# Altium schematic sheet ADC.SchDoc
size 420 x 297 mm; Address1: Address1; Address2: Address2; Address3: Address3; Address4: Address4; SheetNumber: 1; Scale: 1:1; Разраб.: Иванов; Обозначение документа: ADC; Пров.: Петров; Утв.: Сидоров; Наименование организации: ОАО "Концерн "МПО-Гидроприбор"; Перв. применение: АБВГ.123456.000; Наименование изделия 1: Плата; Наименование изделия 2: Схема электрическая; Наименование изделия 3: принципиальная; Нач. отд.: Нач. отд.; Фамилия нач. отд.: Сидоров
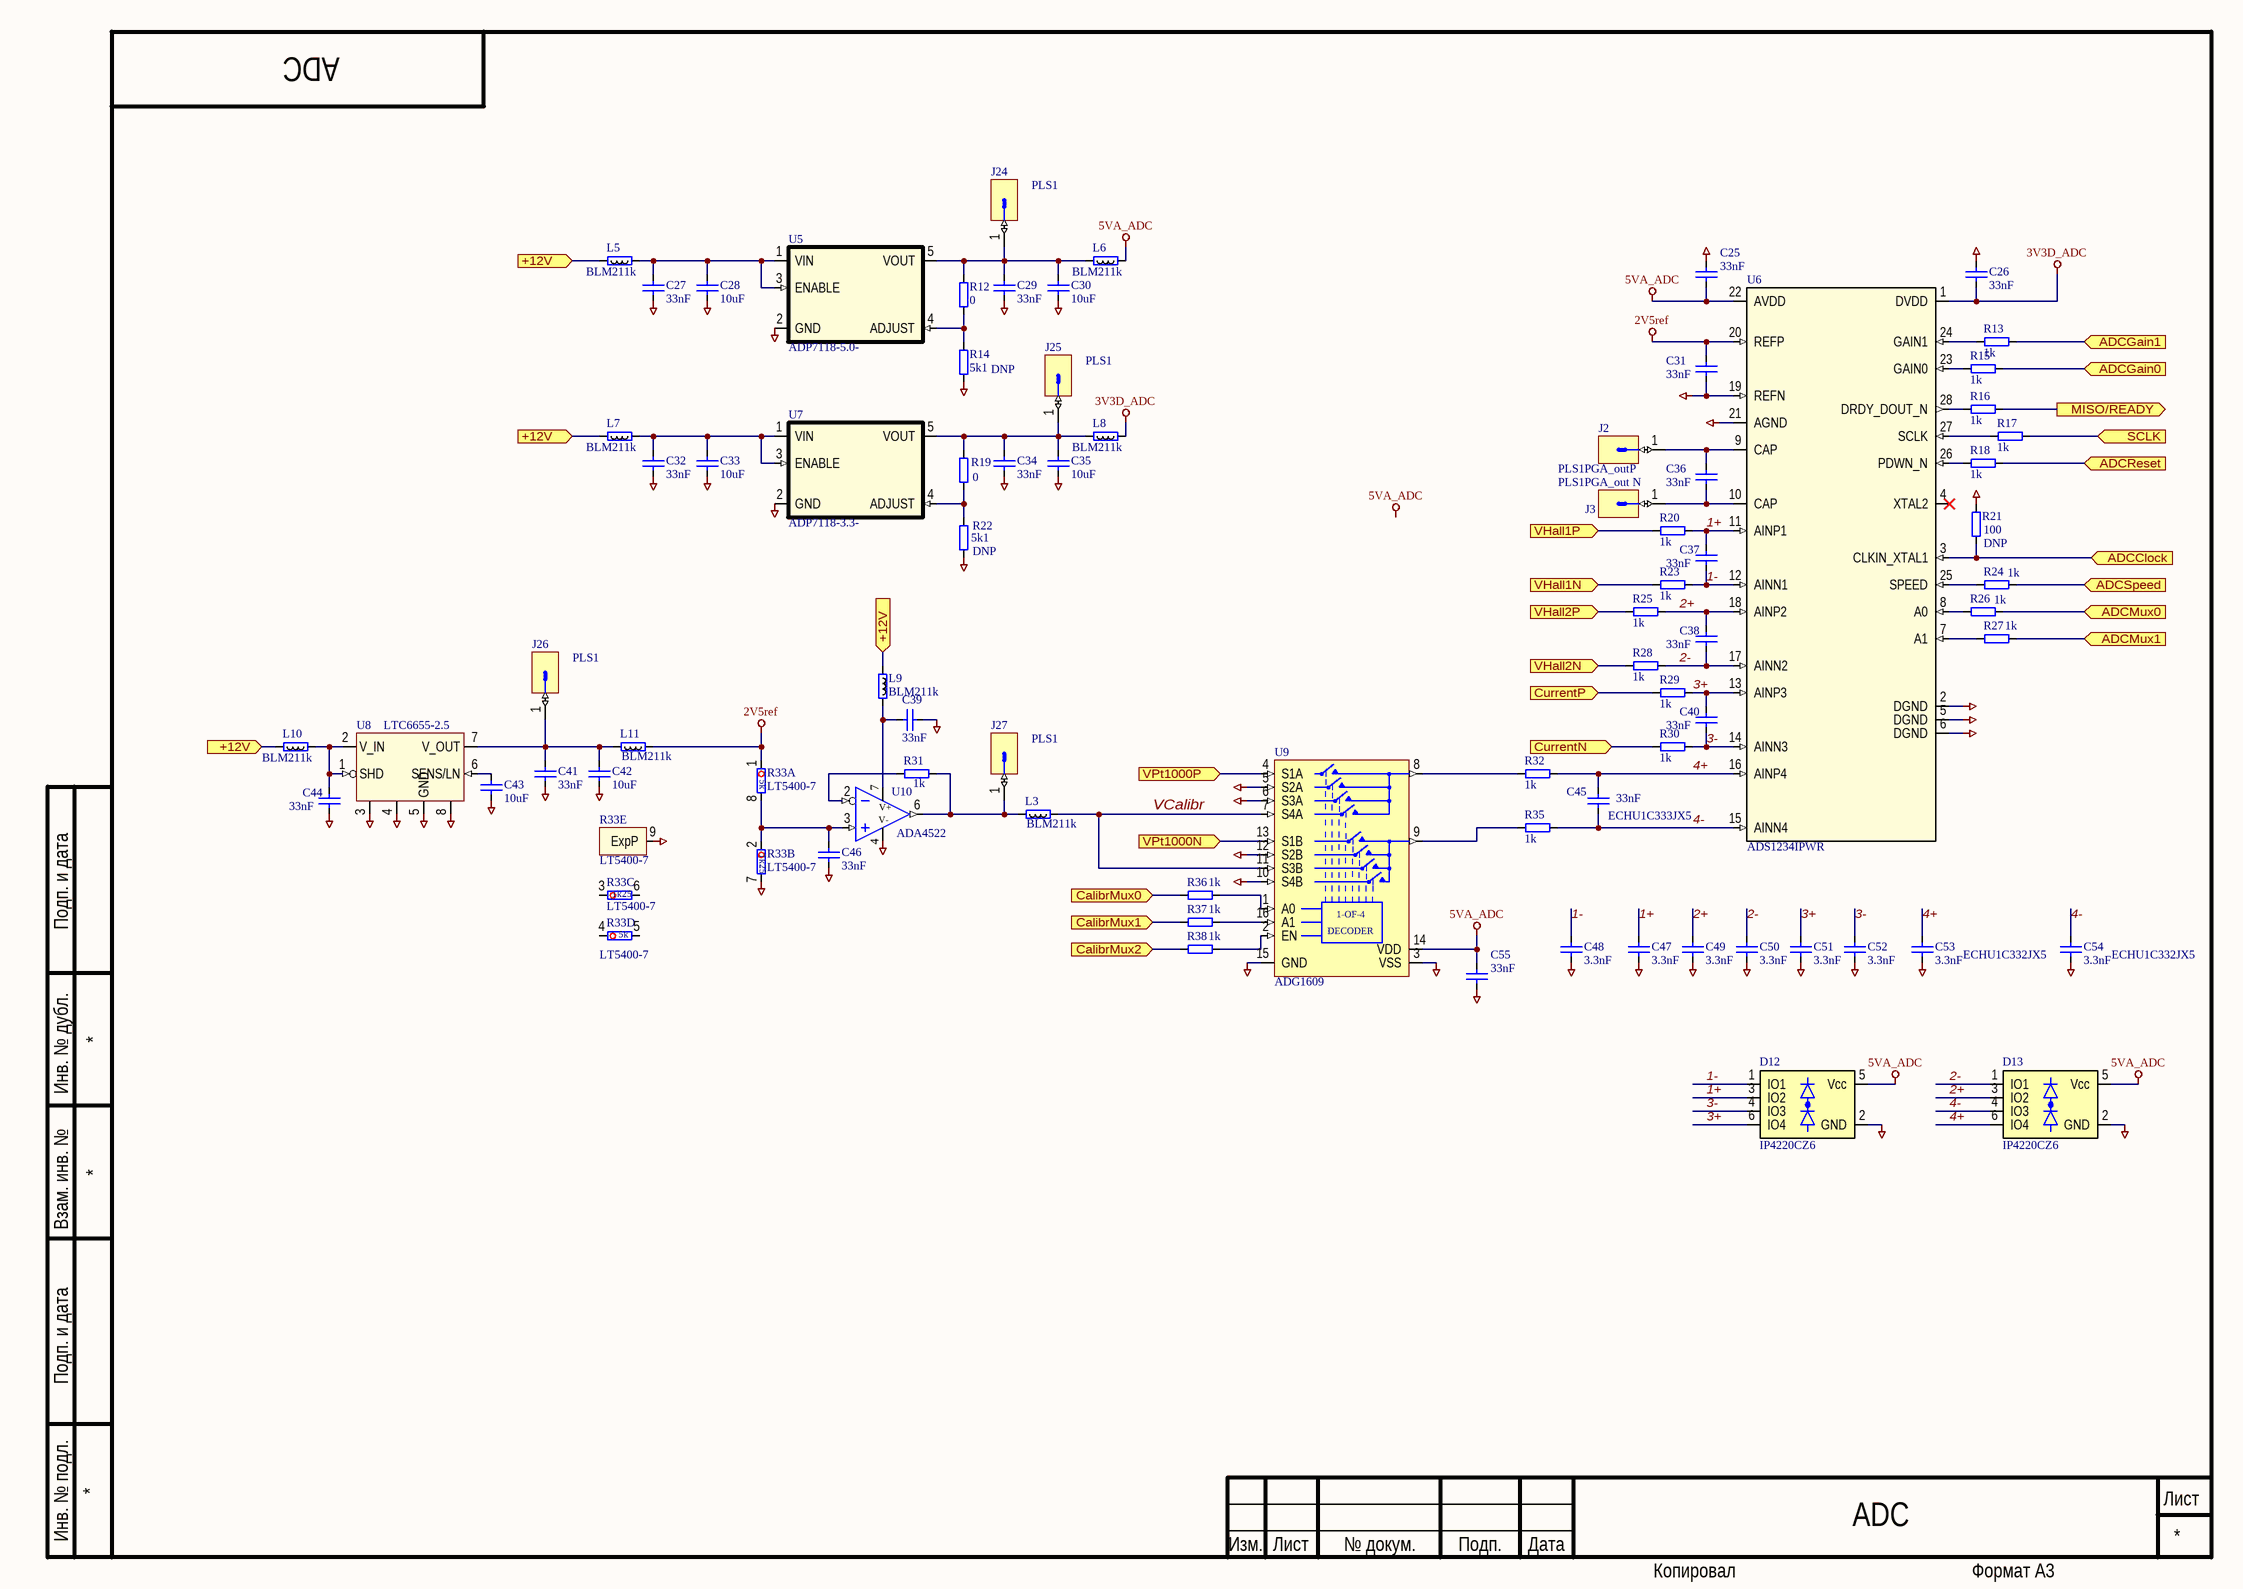
[diagram p0: ADC.SchDoc]

## Parts
C25  33nF  [CAPC1608X87N]
C26  33nF  [CAPC1608X87N]
C27  33nF  [SMD0805CAP]
C28  10uF  [SMD0805CAP]
C29  33nF  [SMD0805CAP]
C30  10uF  [SMD0805CAP]
C31  33nF  [CAPC1608X87N]
C32  33nF  [SMD0805CAP]
C33  10uF  [SMD0805CAP]
C34  33nF  [SMD0805CAP]
C35  10uF  [SMD0805CAP]
C36  33nF  [CAPC1608X87N]
C37  33nF  [CAPC1608X87N]
C38  33nF  [CAPC1608X87N]
C39  33nF  [SMD0805CAP]
C40  33nF  [CAPC1608X87N]
C41  33nF  [SMD0805CAP]
C42  10uF  [SMD0805CAP]
C43  10uF  [SMD0805CAP]
C44  33nF  [SMD0805CAP]
C45  33nF  Name to order: ECHU1C333JX5  [CAPC1206]
C46  33nF  [SMD0805CAP]
C47  3.3nF  [CAPC1608X87N]
C48  3.3nF  [CAPC1608X87N]
C49  3.3nF  [CAPC1608X87N]
C50  3.3nF  [CAPC1608X87N]
C51  3.3nF  [CAPC1608X87N]
C52  3.3nF  [CAPC1608X87N]
C53  3.3nF  Name to order: ECHU1C332JX5  [SMD0805CAP]
C54  3.3nF  Name to order: ECHU1C332JX5  [SMD0805CAP]
C55  33nF  [CAPC1608X87N]
D12  IP4220CZ6  [SOT95P270X145-6N]
D13  IP4220CZ6  [SOT95P270X145-6N]
J2  PLS1PGA_outP  [PLS1]
J3  PLS1PGA_out N  [PLS1]
J24  PLS1  [PLS1]
J25  PLS1  [PLS1]
J26  PLS1  [PLS1]
J27  PLS1  [PLS1]
L3  BLM211k  [RESC2012X50N]
L5  BLM211k  [RESC2012X50N]
L6  BLM211k  [RESC2012X50N]
L7  BLM211k  [RESC2012X50N]
L8  BLM211k  [RESC2012X50N]
L9  BLM211k  [RESC2012X50N]
L10  BLM211k  [RESC2012X50N]
L11  BLM211k  [RESC2012X50N]
R12  0  [SMD0805RES]
R13  1k  [SMD0805RES]
R14  5k1  Solder Option: DNP  [SMD0805RES]
R15  1k  [SMD0805RES]
R16  1k  [SMD0805RES]
R17  1k  [SMD0805RES]
R18  1k  [SMD0805RES]
R19  0  [SMD0805RES]
R20  1k  [SMD0805RES]
R21  100  Solder Option: DNP  [SMD0805RES]
R22  5k1  Solder Option: DNP  [SMD0805RES]
R23  1k  [SMD0805RES]
R24  1k  [SMD0805RES]
R25  1k  [SMD0805RES]
R26  1k  [SMD0805RES]
R27  1k  [SMD0805RES]
R28  1k  [SMD0805RES]
R29  1k  [SMD0805RES]
R30  1k  [SMD0805RES]
R31  1k  [SMD0805RES]
R32  1k  [SMD0805RES]
R33  LT5400-7  [SOP65P488X110-9N-R178X241]  (parts A,B,C,D,E of 5)
R35  1k  [SMD0805RES]
R36  1k  [SMD0805RES]
R37  1k  [SMD0805RES]
R38  1k  [SMD0805RES]
U5  ADP7118-5.0-  [SOT23-5]
U6  ADS1234IPWR  [SOP65P780X200-28N]
U7  ADP7118-3.3-  [SOT23-5]
U8  LTC6655-2.5  [SOP65P488X110-8N]
U9  ADG1609  [TSSOP-16]
U10  ADA4522  [SOP65P488X110-8N]

## Ports
+12V (in), ADCClock (in), ADCGain0 (in), ADCGain1 (in), ADCMux0 (in), ADCMux1 (in), ADCReset (in), ADCSpeed (in), CalibrMux0 (in), CalibrMux1 (in), CalibrMux2 (in), CurrentN (in), CurrentP (in), MISO/READY (out), SCLK (in), VHall1N (in), VHall1P (in), VHall2N (in), VHall2P (in), VPt1000N (in), VPt1000P (in)

## Nets
2V5ref: C31.2 L11.2 R33.1 U6.20(REFP)
3V3D_ADC: C26.1 L8.2 U6.1(DVDD)
5VA_ADC: C25.1 C55.2 D12.5(Vcc) D13.5(Vcc) L6.2 U6.22(AVDD) U9.14(VDD)
GND: C25.2 C26.2 C27.1 C28.1 C29.1 C30.1 C31.1 C32.1 C33.1 C34.1 C35.1 C39.1 C41.1 C42.1 C43.1 C44.1 C46.1 C47.1 C48.1 C49.1 C50.1 C51.1 C52.1 C53.1 C54.1 C55.1 D12.2(GND) D13.2(GND) R14.1 R21.2 R22.1 R33.7 R33.9(ExpP) U5.2(GND) U6.2(DGND) U6.5(DGND) U6.6(DGND) U6.19(REFN) U6.21(AGND) U7.2(GND) U8.3(GND) U8.4(GND) U8.5(GND) U8.8(GND) U9.3(VSS) U9.5(S2A) U9.6(S3A) U9.10(S4B) U9.12(S2B) U9.15(GND) U10.4(V-)
1+: C37.2 C47.2 D12.3(IO2) R20.2 U6.11(AINP1)
1-: C37.1 C48.2 D12.1(IO1) R23.2 U6.12(AINN1)
2+: C38.2 C49.2 D13.3(IO2) R25.2 U6.18(AINP2)
2-: C38.1 C50.2 D13.1(IO1) R28.2 U6.17(AINN2)
3+: C40.2 C51.2 D12.6(IO4) R29.2 U6.13(AINP3)
3-: C40.1 C52.2 D12.4(IO3) R30.2 U6.14(AINN3)
4+: C45.2 C53.2 D13.6(IO4) R32.2 U6.16(AINP4)
4-: C45.1 C54.2 D13.4(IO3) R35.2 U6.15(AINN4)
+12V: L5.1 L7.1 L9.2 L10.1 ; port +12V
ADCClock: R21.1 U6.3(CLKIN_XTAL1) ; port ADCClock
ADCGain0: R15.2 ; port ADCGain0
ADCGain1: R13.2 ; port ADCGain1
ADCMux0: R26.2 ; port ADCMux0
ADCMux1: R27.2 ; port ADCMux1
ADCReset: R18.2 ; port ADCReset
ADCSpeed: R24.2 ; port ADCSpeed
CalibrMux0: R36.1 ; port CalibrMux0
CalibrMux1: R37.1 ; port CalibrMux1
CalibrMux2: R38.1 ; port CalibrMux2
CurrentN: R30.1 ; port CurrentN
CurrentP: R29.1 ; port CurrentP
MISO/READY: R16.2 ; port MISO/READY
SCLK: R17.2 ; port SCLK
VCalibr: L3.2 U9.7(S4A) U9.11(S3B)
VHall1N: R23.1 ; port VHall1N
VHall1P: R20.1 ; port VHall1P
VHall2N: R28.1 ; port VHall2N
VHall2P: R25.1 ; port VHall2P
VPt1000N: U9.13(S1B) ; port VPt1000N
VPt1000P: U9.4(S1A) ; port VPt1000P
NetC27_2: C27.2 C28.2 L5.2 U5.1(VIN) U5.3(ENABLE)
NetC29_2: C29.2 C30.2 J24.1 L6.1 R12.2 U5.5(VOUT)
NetC32_2: C32.2 C33.2 L7.2 U7.1(VIN) U7.3(ENABLE)
NetC34_2: C34.2 C35.2 J25.1 L8.1 R19.2 U7.5(VOUT)
NetC36_1: C36.1 J3.1 U6.10(CAP)
NetC36_2: C36.2 J2.1 U6.9(CAP)
NetC39_2: C39.2 L9.1 U10.7(V+)
NetC41_2: C41.2 C42.2 J26.1 L11.1 U8.7(V_OUT)
NetC43_2: C43.2 U8.6(SENS/LN)
NetC44_2: C44.2 L10.2 U8.1(SHD) U8.2(V_IN)
NetC46_2: C46.2 R33.2 R33.8 U10.3(IN+)
NetJ27_1: J27.1 L3.1 R31.2 U10.6(OUT)
NetR12_1: R12.1 R14.2 U5.4(ADJUST)
NetR13_1: R13.1 U6.24(GAIN1)
NetR15_1: R15.1 U6.23(GAIN0)
NetR16_1: R16.1 U6.28(DRDY_DOUT_N)
NetR17_1: R17.1 U6.27(SCLK)
NetR18_1: R18.1 U6.26(PDWN_N)
NetR19_1: R19.1 R22.2 U7.4(ADJUST)
NetR24_1: R24.1 U6.25(SPEED)
NetR26_1: R26.1 U6.8(A0)
NetR27_1: R27.1 U6.7(A1)
NetR31_1: R31.1 U10.2(IN-)
NetR32_1: R32.1 U9.8(DA)
NetR35_1: R35.1 U9.9(DB)
NetR36_2: R36.2 U9.1(A0)
NetR37_2: R37.2 U9.16(A1)
NetR38_2: R38.2 U9.2(EN)

Not connected (* = marked no-connect by the designer): R33 3 4 5 6; U6 4(XTAL2)*

## Notes on the sheet
- Labels drawn without touching a wire or pin: 5VA_ADC
- Подп. и дата
- Инв. № дубл.
- Взам. инв. №
- Инв. № подл.
- Изм.
- Лист
- № докум.
- Подп.
- Дата
- Копировал
- Формат А3
- (in symbol ADG1609) 1-OF-4; DECODER
- (in symbol LT5400_7, part A) 5k
- (in symbol LT5400_7, part B) 1k25
- (in symbol LT5400_7, part C) 1k25
- (in symbol LT5400_7, part D) 5k

## Library data of the parts
C25 C26 C31 C36-C38 C40 C47-C52 C55 = C0603: Чип конденсатор 0603; Voltage: 50V; Vendor: Vishay; DielectricType: X5R; SMD Solders: 2; Solder Option: RM; Tolerance: 20%; Pkg: SMD0603; Device: Cap603; Price: 2
  C25 C26 C31 C36-C38 C40 C55: Value: 33nF
  C47-C52: Value: 3.3nF
C27-C30 C32-C35 C39 C41-C44 C46 C53 C54 = C0805: Чип конденсатор 0805; Voltage: 25V; Vendor: Vishay; DielectricType: X5R; SMD Solders: 2; Solder Option: RM; Tolerance: 20%; Pkg: SMD0805; Device: Cap0805; Price: 2
  C27 C29 C32 C34 C39 C41 C44 C46: Value: 33nF
  C28 C30 C33 C35 C42 C43: Value: 10uF
  C53 C54: Value: 3.3nF
C45 = C1206: Чип конденсатор 1206; Voltage: 16V; Vendor: Vishay; DielectricType: X5R; SMD Solders: 2; Solder Option: RM; Tolerance: 1%; Pkg: SMD1206; Device: Cap1206; Value: 33nF; Price: 2
D12 D13 = IP4220: Optotransistor; Pkg: SOT23-6; SMD Solders: 6; Solder Option: RM; THD Solders: 0; Vendor: NXP; Voltage: 6V; Device: IP4220CZ6; Price: 10; Name to order: IP4220CZ6; Current: 0
J2 J3 J24-J27 = PLS1: Штырь PLS1; Vendor: Confly; SMD Solders: 0; Solder Option: RM; THD Solders: 1; Price: 1; Device: PLS1
  J2: Value: PGA_outP
  J3: Value: PGA_out N
L3 L5-L11 = BLM21: SMD Ferrite bead 0805; Vendor: Vishay; Value: 1k; Pkg: SMD0805; SMD Solders: 2; Solder Option: RM; Price: 10; Device: BLM21
R12 R13 R15-R20 R23-R32 R35-R38 = R0805: Чип резистор 0805; Vendor: Vishay; SMD Solders: 2; Solder Option: RM; TC: 100ppm/C; Tolerance: 1%; Pkg: SMD0805; Pwr: 125mW; Device: Res0805; Price: 2
  R12 R19: Value: 0
  R13 R15-R18 R20 R23-R32 R35-R38: Value: 1k
R14 R21 R22 = R0805: Чип резистор 0805; Vendor: Vishay; SMD Solders: 2; TC: 100ppm/C; Tolerance: 1%; Pkg: SMD0805; Pwr: 125mW; Device: Res0805; Price: 2
  R14 R22: Value: 5k1
  R21: Value: 100
R33 = LT5400_7: 4 прецизионных резистора; Vendor: Analog Devices; SMD Solders: 0; Solder Option: i; TC: 200ppb/C; Tolerance: 0..025%; Pkg: MSOP 9-0.65; Pwr: 40C/W; Device: LT5400; Name to order: LT5400BMPMS8E-7#PBF; Value: -7; Price: 2; THD Solders: 0
U5 = ADP7118: Positive LDO Linear stabilizer; Vendor: Analog Devoces; Value: -5.0-; SMD Solders: 5; Solder Option: RM; Name to order: ADP7118AUJZ-5.0-R7; Pkg: SOT23-5; Price: 100; Device: ADP7118
U6 = ADS1234: АЦП; Pkg: SOIC8_EP; SMD Solders: 28; Solder Option: RM; TC: 10-300nV/C; THD Solders: 0; Vendor: Texas  Instruments; Voltage: 2V7 to 5V3; Current: 3; Device: ADS1234; Price: 1500; Name to order: ADS1234IPWR
U7 = ADP7118: Positive LDO Linear stabilizer; Vendor: Analog Devoces; Value: -3.3-; SMD Solders: 5; Solder Option: RM; Name to order: ADP7118AUJZ-3.3-R7; Pkg: SOT23-5; Price: 100; Device: ADP7118
U8 = LTC6655B-5: Low noise precision reference,; Name to order: LTC6655LNBHMS8-2.5; Pkg: MSOP65-8; SMD Solders: 8; Solder Option: RM; TC: 2ppm/C; Value: -2.5; Vendor: Analog Devices Inc; Voltage: max13.2V; Price: 6000; Device: LTC6655
U9 = ADG1609: Мультиплексор аналоговый дифференциальный 4 канала; Vendor: Analog Devoces; Pkg: TSSOP65-16; SMD Solders: 16; Solder Option: RM; THD Solders: 0; Name to order: ADG1608BRUZ; Price: 700; Device: ADG1609; Current: 0
U10 = ADA4522: Op amp; Pkg: MASOP8-65; SMD Solders: 8; Solder Option: RM; TC: 1uV/C; Vendor: Analog Devices Inc; Voltage: +-5 to +-27.5V; Current: 1; Device: ADA4522; Price: 600